# Altium project SF16_POWER.PrjPcb
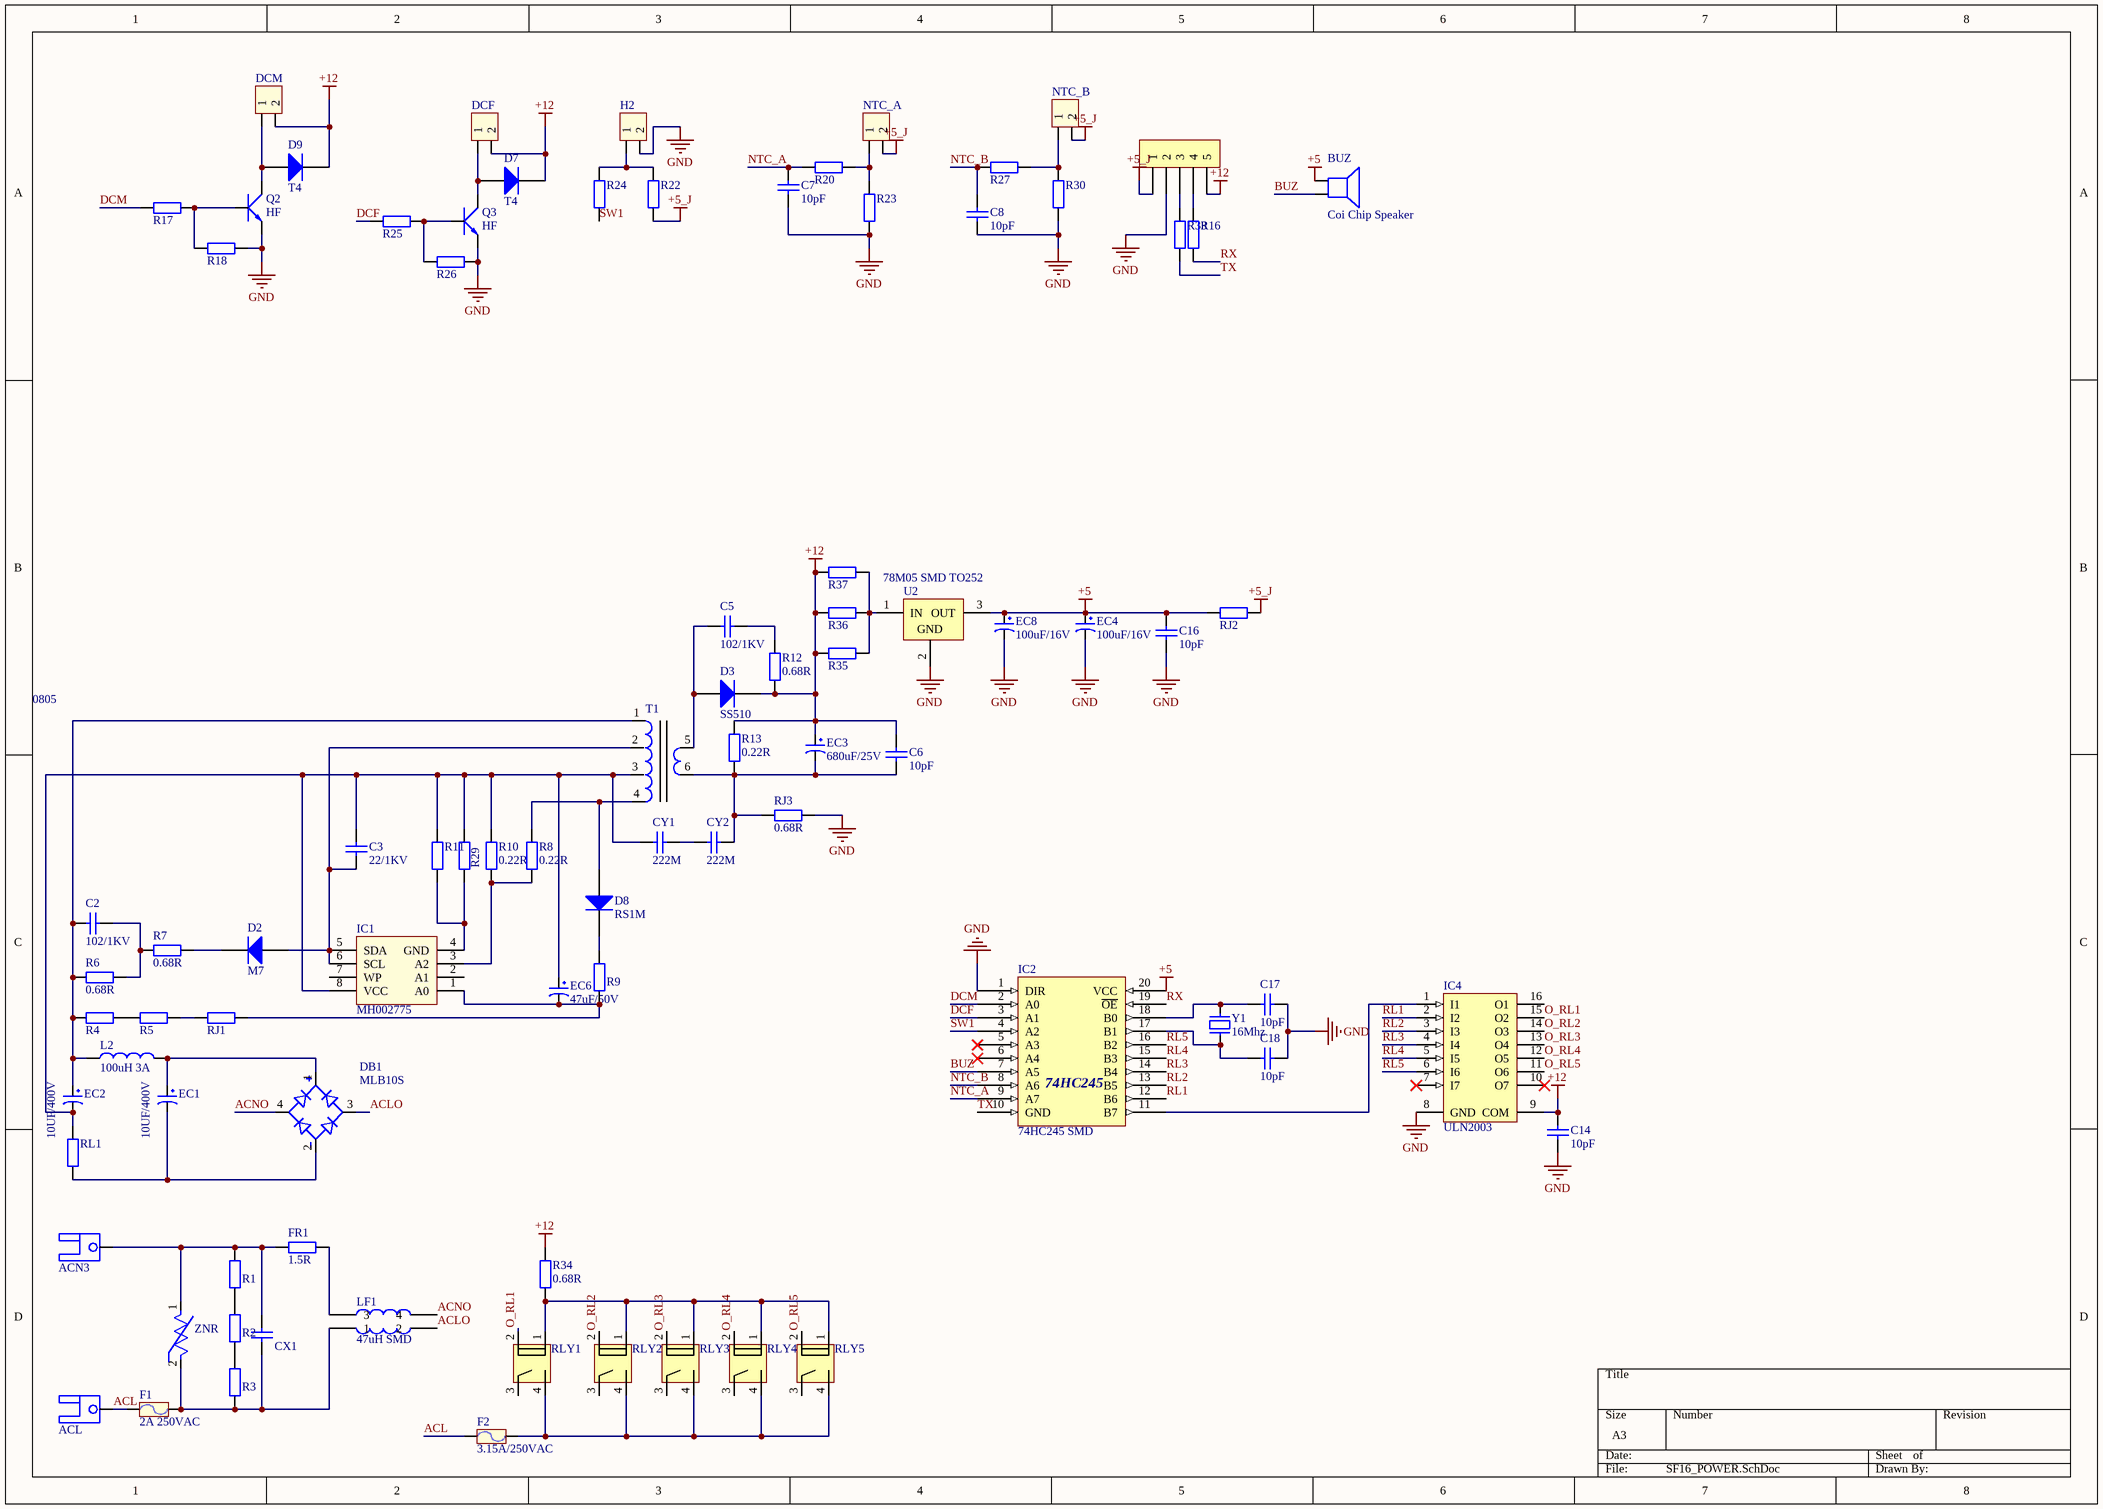
[diagram p0: SF16_POWER.SchDoc]
1 sheet, 87 parts. Net scope: global (net labels, ports and power ports of the same name join across sheets).
Board file: SF16_POWER.PcbDoc

## Sheet SF16_POWER.SchDoc
size A3; SheetNumber: 1; SheetTotal: 1

### Parts
ACL  1217861-1  [CON1_P192_70D137_TH_ST]  (value not drawn)
ACN3  1217861-1  [CON1_P192_70D137_TH_ST]  (value not drawn)
BUZ  Coi Chip Speaker  [Coi 14mm]
C2  102/1KV  [TU GOM CAO AP]
C3  22/1KV  [TU GOM CAO AP]
C5  102/1KV  [TU GOM CAO AP]
C6  10pF  [tu 0805]
C7  10pF  [tu 0805]
C8  10pF  [tu 0805]
C14  10pF  [tu 0805]
C16  10pF  [tu 0805]
C17  10pF  [tu 0805]
C18  10pF  [tu 0805]
CX1  0.1  [Tu vuong 10mm]  (value not drawn)
CY1  222M  [TU GOM CAO AP 222M]
CY2  222M  [TU GOM CAO AP 222M]
D2  M7  [DIODE SMA]
D3  SS510  [DIODE SMA]
D7  T4  [DIODE SOD-123]
D8  RS1M  [DIODE SMA]
D9  T4  [DIODE SOD-123]
DB1  MLB10S  [MBLS-1]
DCF  Header 2P 2.54 Duc Thang  [XH2.54M-2]  (value not drawn)
DCM  Header 2P 2.54 Duc Thang  [XH2.54M-2]  (value not drawn)
EC1  10UF/400V  [tu hoa 10mm]
EC2  10UF/400V  [tu hoa 10mm]
EC3  680uF/25V  [tu hoa 10mm]
EC4  100uF/16V  [tu hoa 5mm]
EC6  47uF/50V  [tu hoa 5mm]
EC8  100uF/16V  [tu hoa 5mm]
F1  2A 250VAC  [Cau chi 2A 250V T2A250V]
F2  3.15A/250VAC  [Cau Chi 250V]
FR1  1.5R  [TRO CAU CHI DUNG]
H2  Header 2P 2.54 Duc Thang  [XH2.54M-2]  (value not drawn)
H5  Header 5P 2.54 DT  [XH2.54M-5]  (value not drawn)
IC1  MH002775  [DIP8]
IC2  74HC245 SMD  [SOP 20]
IC4  ULN2003  [SOP 16]
L2  100uH 3A  [CUON CAM - duplicate]
LF1  47uH SMD  [Cuon Cam AC-AC]
NTC_A  Header 2P 2.54 Duc Thang  [XH2.54M-2]  (value not drawn)
NTC_B  Header 2P 2.54 Duc Thang  [XH2.54M-2]  (value not drawn)
Q2  HF  [SOT-23]
Q3  HF  [SOT-23]
R1  0.68R  [tro smd 1206]  (value not drawn)
R2  0.68R  [tro smd 1206]  (value not drawn)
R3  0.68R  [tro smd 1206]  (value not drawn)
R4  0.68R  [tro smd 1206]  (value not drawn)
R5  0.68R  [tro smd 1206]  (value not drawn)
R6  0.68R  [tro smd 1206]
R7  0.68R  [tro smd 1206]
R8  0.22R  [tro smd 0805]
R9  0.68R  [tro smd 1206]  (value not drawn)
R10  0.22R  [tro smd 0805]
R11  0.68R  [tro smd 1206]  (value not drawn)
R12  0.68R  [tro smd 1206]
R13  0.22R  [tro smd 0805]
R16  0.22R  [tro smd 0805]  (value not drawn)
R17  0.68R  [tro smd 1206]  (value not drawn)
R18  0.22R  [tro smd 0805]  (value not drawn)
R20  0.22R  [tro smd 0805]  (value not drawn)
R22  0.22R  [tro smd 0805]  (value not drawn)
R23  0.22R  [tro smd 0805]  (value not drawn)
R24  0.22R  [tro smd 0805]  (value not drawn)
R25  0.68R  [tro smd 1206]  (value not drawn)
R26  0.22R  [tro smd 0805]  (value not drawn)
R27  0.22R  [tro smd 0805]  (value not drawn)
R29  0.68R  [tro smd 1206]  (value not drawn)
R30  0.22R  [tro smd 0805]  (value not drawn)
R33  0.68R  [tro smd 1206]  (value not drawn)
R34  0.68R  [tro smd 1206]
R35  0.68R  [tro smd 1206]  (value not drawn)
R36  0.68R  [tro smd 1206]  (value not drawn)
R37  0.68R  [tro smd 1206]  (value not drawn)
RJ1  0.68R  [tro smd 1206]  (value not drawn)
RJ2  0.68R  [tro smd 1206]  (value not drawn)
RJ3  0.68R  [tro smd 1206]
RL1  0.68R  [tro smd 1206]  (value not drawn)
RLY1  Relay JZC-8F-1H  [Relay 4 chan JZC-8F]  (value not drawn)
RLY2  Relay JZC-8F-1H  [Relay 4 chan JZC-8F]  (value not drawn)
RLY3  Relay JZC-8F-1H  [Relay 4 chan JZC-8F]  (value not drawn)
RLY4  Relay JZC-8F-1H  [Relay 4 chan JZC-8F]  (value not drawn)
RLY5  Relay JZC-8F-1H  [Relay 4 chan JZC-8F]  (value not drawn)
T1  Bien ap  [BIEN AP EE1610-12V1.1A]  (value not drawn)
U2  78M05 SMD TO252  [TO252]
Y1  16Mhz  [Thach Anh 2 Chan 32,768 KHz]
ZNR  MOV-07D471KTR  [Tu MOV - duplicate]  (value not drawn)

### Nets
+5: BUZ.2 C16.2 EC4.1 EC8.1 IC2.20(VCC) RJ2.1 U2.3(OUT)
+5_J: H5.1 NTC_A.2 NTC_B.2 R22.1 RJ2.2
+12: C6.2 C14.1 D3.2(K) D7.2(K) D9.2(K) DCF.2 DCM.2 EC3.1 H5.5 IC4.9(COM) R12.2 R13.1 R34.2 R35.2 R36.2 R37.2
GND: C7.1 C8.1 C14.2 C16.1 C17.2 C18.1 EC4.2 EC8.2 H2.2 H5.2 IC2.1(DIR) IC4.8(GND) Q2.2(E) Q3.2(E) R18.2 R23.1 R26.2 R30.1 RJ3.1 U2.2(GND)
ACL: ACL.1 F1.1 F2.1
ACLO: DB1.3(AC2) LF1.2
ACNO: DB1.4(AC1) LF1.4
BUZ: BUZ.1 IC2.7(A5)
DCF: IC2.3(A1) R25.1
DCM: IC2.2(A0) R17.1
NTC_A: C7.2 IC2.9(A7) R20.1
NTC_B: C8.2 IC2.8(A6) R27.1
O_RL1: IC4.15(O2) RLY1.2
O_RL2: IC4.14(O3) RLY2.2
O_RL3: IC4.13(O4) RLY3.2
O_RL4: IC4.12(O5) RLY4.2
O_RL5: IC4.11(O6) RLY5.2
RL1: IC2.12(B6) IC4.2(I2)
RL2: IC2.13(B5) IC4.3(I3)
RL3: IC2.14(B4) IC4.4(I4)
RL4: IC2.15(B3) IC4.5(I5)
RL5: IC2.16(B2) IC4.6(I6)
RX: IC2.19(~{OE}) R16.1
SW1: IC2.4(A2) R24.1
TX: IC2.10(GND) R33.1
NetACN3_1: ACN3.1 CX1.2 FR1.2 R1.2 ZNR.1
NetC2_1: C2.1 R6.2 R7.1
NetC2_2: C2.2 EC2.1 L2.2 R4.2 R6.1 T1.1
NetC3_1: C3.1 D2.1(A) IC1.5(SDA) IC1.6(SCL) T1.2
NetC3_2: C3.2 CY1.2 EC2.2 EC6.1 IC1.8(VCC) R10.1 R11.2 R29.2 RL1.2 T1.3
NetC5_1: C5.1 R12.1
NetC5_2: C5.2 D3.1(A) T1.5
NetC6_1: C6.1 CY2.1 EC3.2 R13.2 RJ3.2 T1.6
NetC17_1: C17.1 IC2.18(B0) Y1.1
NetC18_2: C18.2 IC2.17(B1) Y1.2
NetCX1_1: CX1.1 F1.2 LF1.1 R3.1 ZNR.2
NetCY1_1: CY1.1 CY2.2
NetD2_2: D2.2(K) R7.2
NetD7_1: D7.1(A) DCF.1 Q3.3(C)
NetD8_1: D8.1(A) R8.1 T1.4
NetD8_2: D8.2(K) R9.1
NetD9_1: D9.1(A) DCM.1 Q2.3(C)
NetDB1_1: DB1.1(POS) EC1.1 L2.1
NetDB1_2: DB1.2(NEG) EC1.2 RL1.1
NetEC6_2: EC6.2 IC1.1(A0) R9.2 RJ1.1
NetF2_2: F2.2 RLY1.4(AC/DC) RLY2.4(AC/DC) RLY3.4(AC/DC) RLY4.4(AC/DC) RLY5.4(AC/DC)
NetFR1_1: FR1.1 LF1.3
NetH2_1: H2.1 R22.2 R24.2
NetH5_3: H5.3 R33.2
NetH5_4: H5.4 R16.2
NetIC1_3: IC1.3(A2) R8.2 R10.2
NetIC1_4: IC1.4(GND) R11.1 R29.1
NetIC2_11: IC2.11(B7) IC4.1(I1)
NetNTC_A_1: NTC_A.1 R20.2 R23.2
NetNTC_B_1: NTC_B.1 R27.2 R30.2
NetQ2_1: Q2.1(B) R17.2 R18.1
NetQ3_1: Q3.1(B) R25.2 R26.1
NetR1_1: R1.1 R2.2
NetR2_1: R2.1 R3.2
NetR4_1: R4.1 R5.2
NetR5_1: R5.1 RJ1.2
NetR34_1: R34.1 RLY1.1 RLY2.1 RLY3.1 RLY4.1 RLY5.1
NetR35_1: R35.1 R36.1 R37.1 U2.1(IN)

Not connected (* = marked no-connect by the designer): IC1 2(A1) 7(WP); IC2 5(A3)* 6(A4)*; IC4 7(I7)* 10(O7)* 16(O1); RLY1 3(AC/DC); RLY2 3(AC/DC); RLY3 3(AC/DC); RLY4 3(AC/DC); RLY5 3(AC/DC)

### Notes on the sheet
- 0805
- (in symbol 74HC245 SMD) 74HC245

### Library data of the parts
ACL ACN3 = CON-PLG-SPADE_1X1-256-ST-TH: 1 Pins, 1 Row 256mil Pitch, Straight, Male; Manufacturer: TE Connectivity; Mating Part Number: 2-520183-2; Alternate Part Number-1: NA; Manufacturer Part Number: 1217861-1; Case/Package: TH-CON; Supplier-1: ARROW; Supplier Part Number-1: 1217861-1
BUZ = Coi 14mm: Còi chip
C2 C3 C5 = Tu gom CAO AP: Cắm; Don_Vi: Con; So_Chan: 2; Ten_Linh_Kien: Tụ gốm 15P 50V; Ma_Hang: MH004767; Chung_Loai: Cắm; Kieu_Chan: *
C6-C8 C14 C16-C18 = Tu 0805 10pF 50V 10%: Dán; Don_Vi: Con; So_Chan: 2; Ten_Linh_Kien: Tụ 0805 10P 10% 50V; Ma_Hang: MH004554; Chung_Loai: Dán; Kieu_Chan: *
CX1 = Tu MKP X2 0.1uF 275VAC 10MM: Cắm; Don_Vi: Con; So_Chan: 2; Ten_Linh_Kien: Tụ tantalum 224-0.22uF 50V DIP5.08 sứ vàng; Ma_Hang: MH007473; Chung_Loai: Cắm; Kieu_Chan: *
CY1 CY2 = Tu gom CAO AP 222M: Cắm; Don_Vi: Con; So_Chan: 2; Ten_Linh_Kien: Tụ gốm 15P 50V; Ma_Hang: MH004767; Chung_Loai: Cắm; Kieu_Chan: *
D2 = Diode M7 1N4007 SMD 1A 1000V: Dán; Don_Vi: Con; Ma_Hang: MH000944; Chung_Loai: Dán; Ten_Linh_Kien: Diode M7 1N4007 SMD 1A 1000V; Ghi_Chu: *
D3 D8 = Diode SS34 ( 1N5822 ): Dán; Don_Vi: Con; Ma_Hang: MH002104; Ten_Linh_Kien: Diode SS34 3A 40V SMA ( 1N5822 SS34A); Kieu_Chan: *; Chung_Loai: Dán
D7 D9 = Diode S4: Dán; Ten_Linh_Kien: Diode S4 SOD123 ( 1N5819 SOD123); Ma_Hang: MH005519; Don_Vi: Con; Ghi_Chu: *; Chung_Loai: Dán; Kieu_Chan: *
DB1 = MLB10S: DÁN
DCF DCM H2 NTC_A NTC_B = Header 2P 2.54 Duc Thang: Cắm; Ten_Linh_Kien: Header 2P XH2.54-2P Đực Thẳng; Don_Vi: Con; Ma_Hang: MH001283; Chung_Loai: Cắm
EC1 EC2 = Tu Hoa 1000uF 10V 10x12: Cắm; So_Chan: 2; Don_Vi: Con; Ten_Linh_Kien: Tụ Hóa 1000uF 10V 10x12MM; Ma_Hang: MH006614; Kieu_Chan: *; Chung_Loai: Cắm
EC3 = Tu Hoa 6.8uF 400V 10x17: Cắm; Don_Vi: Con; So_Chan: 2; Ten_Linh_Kien: Tụ Hóa 6.8uF 400V 10x17MM; Ma_Hang: MH003745; Chung_Loai: Cắm; Kieu_Chan: *
EC4 EC8 = Tu Hoa 330uF 10V 6x11: Cắm; Don_Vi: Con; So_Chan: 2; Ten_Linh_Kien: Tụ Hóa 330uF 10V 6x11MM; Ma_Hang: MH008830; Chung_Loai: Cắm; Kieu_Chan: *
EC6 = Tu Hoa 47uF 16V 5x10: Cắm; Don_Vi: Con; So_Chan: 2; Ten_Linh_Kien: Tụ Hóa 47uF 16V; Ma_Hang: MH006859; Chung_Loai: Cắm; Kieu_Chan: *
F1 F2 = Cau chi 2A 250V T2A250V: Cắm; Ma_Hang: MH010033; Ten: Cầu Chì Tự Phục Hồi 2A 24V SMD1812
FR1 = Tro Vach 2W: Cắm; So_Chan: 2; Ten_Linh_Kien: Trở 1% 2w 1.5R; Don_Vi: Con; Ma_Hang: MH006312; Chung_Loai: Cắm; Kieu_Chan: *
H5 = Header 5P 2.54 DT: Cắm; Ten_Linh_Kien: Header 5P XH2.54-5P Đực Thẳng; Don_Vi: Con; Ma_Hang: MH001298; Chung_Loai: Cắm
IC1 = AT24C01 DIP8 EEPROM: Cắm; Ten_Linh_Kien: AT24C01 DIP8 EEPROM 1KBIT; Don_Vi: Con; Kieu_Chan: *; Ghi_Chu: *; Ma_Hang: MH002775; Chung_Loai: Cắm
IC2 = 74HC245 SMD: Dán; Ten_Linh_Kien: 74HC245DW SSOP20 5.2MM; Don_Vi: Con; Ma_Hang: MH003571; Ghi_Chu: *; Kieu_Chan: *; Chung_Loai: Dán
IC4 = ULN2003A SMD: Dán; Ten_Linh_Kien: ULN2003 SOP16; Don_Vi: Con; Ma_Hang: MH002408; Ghi_Chu: *; Chung_Loai: Dán; Kieu_Chan: *
L2 = CUON CAM VACH DUNG: Dán; Don_Vi: Con; Ma_Hang: MH002209; Ten_Linh_Kien: Cuộn Cảm 100uH 3A 8x10MM; Chung_Loai: Dán; Ghi Chu: *; Kieu Chan: *
LF1 = CUON CAM AC_AC: Dán; Don_Vi: Con; Ma_Hang: MH004211; Ten_Linh_Kien: Cuộn Cảm 47uH 7x7x4MM CD74R; Ghi_Chu: *; Kieu_Chan: *; Chung_Loai: Dán
Q2 Q3 = C1815 SOT23 TRANS NPN 0.15A 50V: Cắm; Value: C9014
R1-R7 R9 R11 R12 R17 R25 R29 R33-R37 RJ1-RJ3 RL1 = Tro 1206: Dán; Don_Vi: Con; Ma_Hang: MH008104; Ten_linh_Kien: Trở 1206 1% 0.68R; So_Chan: 2; Chung_Loai: Dán; Kieu_Chan: *
R8 R10 R13 R16 R18 R20 R22-R24 R26 R27 R30 = Tro 0805: Dán; Don_Vi: Con; So_Chan: 2; Ten_Linh_Kien: Trở 0805 1% 0.22R; Ma_Hang: MH005466; Chung_Loai: Dán; Kieu_Chan: *
RLY1-RLY5 = Relay 4 chan JZC-8F-1H: Relay 4 chan HF46F; Ten: Relay 5V5A HF46F-G 5-HS1; Ma_Hang: MH003879
U2 = 78M05 SMD TO252: Dán; Don_Vi: Con; Ten_Linh_Kien: 78M05 TO252; Ma_Hang: MH001917; Ghi_Chu: *; Kieu_Chan: *; Chung_Loai: Dán
Y1 = Thach Anh 2 chan 32,768 Khz: Crystal For all Crystal 2pin.; Value: 4Mhz
ZNR = Varistor 10D471K 470V: Cam; Manufacturer: Bourns Inc.; Voltage Rating Ac: 300V; Varistor Voltage: 423V; Clamping Current: 10A; Voltage Rating Dc: 385V; Value: 126pF; Voltage Tolerance: 10%; Clamping Voltage: 775V; Package: 0; Octopart: https://octopart.com/mov-07d471ktr-bourns-19184728; Manufacturer Part Number: MOV-07D471KTR; Lead Free: Yes; RoHS: TRUE; Automotive: No; Device Class L2: Varistors; ComponentLink2URL: https://www.bourns.com/docs/product-datasheets/mov07d.pdf?sfvrsn=86ba81fd_26; Temperature Range Low: -40°C; Device Class L1: Circuit Protection; ComponentLink2Description: Datasheet; Device Class L3: unset; Temperature: -40°C to +105°C; Height: 11mm; Category: Res; Mouser Description: Varistors 105pF 470volts 10%; Temperature Range High: +105°C; Capacitance: 126pF; Digikey Description: VARISTOR 470V 1.2KA DISC 7MM